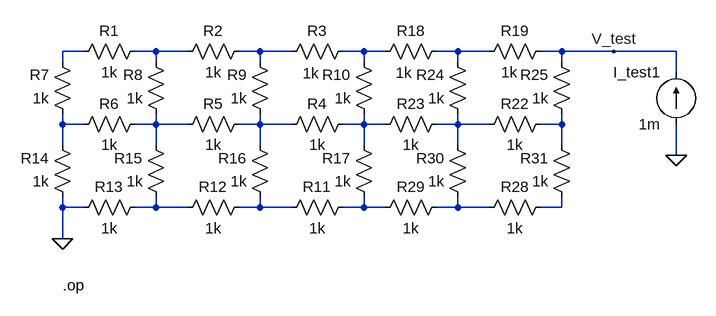
[diagram p0: schematic q2a_mesh_3.asc]
q2a_mesh_3.asc, the LTspice schematic file:
Version 4
SHEET 1 964 680
WIRE -128 48 -160 48
WIRE -16 48 -48 48
WIRE 32 48 -16 48
WIRE 144 48 112 48
WIRE 192 48 144 48
WIRE 304 48 272 48
WIRE 336 48 304 48
WIRE 448 48 416 48
WIRE 496 48 448 48
WIRE 608 48 576 48
WIRE 688 48 608 48
WIRE 784 48 688 48
WIRE -160 64 -160 48
WIRE -16 64 -16 48
WIRE 144 64 144 48
WIRE 304 64 304 48
WIRE 448 64 448 48
WIRE 608 64 608 48
WIRE 784 80 784 48
WIRE -160 160 -160 144
WIRE -128 160 -160 160
WIRE -16 160 -16 144
WIRE -16 160 -48 160
WIRE 32 160 -16 160
WIRE 144 160 144 144
WIRE 144 160 112 160
WIRE 192 160 144 160
WIRE 304 160 304 144
WIRE 304 160 272 160
WIRE 336 160 304 160
WIRE 448 160 448 144
WIRE 448 160 416 160
WIRE 496 160 448 160
WIRE 608 160 608 144
WIRE 608 160 576 160
WIRE -160 192 -160 160
WIRE -16 192 -16 160
WIRE 144 192 144 160
WIRE 304 192 304 160
WIRE 448 192 448 160
WIRE 608 192 608 160
WIRE 784 208 784 160
WIRE -160 288 -160 272
WIRE -128 288 -160 288
WIRE -16 288 -16 272
WIRE -16 288 -48 288
WIRE 32 288 -16 288
WIRE 144 288 144 272
WIRE 144 288 112 288
WIRE 192 288 144 288
WIRE 304 288 304 272
WIRE 304 288 272 288
WIRE 336 288 304 288
WIRE 448 288 448 272
WIRE 448 288 416 288
WIRE 496 288 448 288
WIRE 608 288 608 272
WIRE 608 288 576 288
WIRE -160 336 -160 288
FLAG -160 336 0
FLAG 784 208 0
FLAG 688 48 V_test
SYMBOL res -32 32 R90
WINDOW 0 0 56 VBottom 2
WINDOW 3 32 56 VTop 2
SYMATTR InstName R1
SYMATTR Value 1k
SYMBOL current 784 160 R180
WINDOW 0 24 80 Left 2
WINDOW 3 24 0 Left 2
SYMATTR InstName I_test1
SYMATTR Value 1m
SYMBOL res 128 32 R90
WINDOW 0 0 56 VBottom 2
WINDOW 3 32 56 VTop 2
SYMATTR InstName R2
SYMATTR Value 1k
SYMBOL res 288 32 R90
WINDOW 0 0 56 VBottom 2
WINDOW 3 34 66 VTop 2
SYMATTR InstName R3
SYMATTR Value 1k
SYMBOL res 288 144 R90
WINDOW 0 0 56 VBottom 2
WINDOW 3 32 56 VTop 2
SYMATTR InstName R4
SYMATTR Value 1k
SYMBOL res 128 144 R90
WINDOW 0 0 56 VBottom 2
WINDOW 3 32 56 VTop 2
SYMATTR InstName R5
SYMATTR Value 1k
SYMBOL res -32 144 R90
WINDOW 0 0 56 VBottom 2
WINDOW 3 32 56 VTop 2
SYMATTR InstName R6
SYMATTR Value 1k
SYMBOL res -144 160 R180
WINDOW 0 36 76 Left 2
WINDOW 3 36 40 Left 2
SYMATTR InstName R7
SYMATTR Value 1k
SYMBOL res 0 160 R180
WINDOW 0 36 76 Left 2
WINDOW 3 36 40 Left 2
SYMATTR InstName R8
SYMATTR Value 1k
SYMBOL res 160 160 R180
WINDOW 0 36 76 Left 2
WINDOW 3 36 40 Left 2
SYMATTR InstName R9
SYMATTR Value 1k
SYMBOL res 320 160 R180
WINDOW 0 36 76 Left 2
WINDOW 3 36 40 Left 2
SYMATTR InstName R10
SYMATTR Value 1k
SYMBOL res 288 272 R90
WINDOW 0 0 56 VBottom 2
WINDOW 3 32 56 VTop 2
SYMATTR InstName R11
SYMATTR Value 1k
SYMBOL res 128 272 R90
WINDOW 0 0 56 VBottom 2
WINDOW 3 32 56 VTop 2
SYMATTR InstName R12
SYMATTR Value 1k
SYMBOL res -32 272 R90
WINDOW 0 0 56 VBottom 2
WINDOW 3 32 56 VTop 2
SYMATTR InstName R13
SYMATTR Value 1k
SYMBOL res -144 288 R180
WINDOW 0 36 76 Left 2
WINDOW 3 36 40 Left 2
SYMATTR InstName R14
SYMATTR Value 1k
SYMBOL res 0 288 R180
WINDOW 0 36 76 Left 2
WINDOW 3 36 40 Left 2
SYMATTR InstName R15
SYMATTR Value 1k
SYMBOL res 160 288 R180
WINDOW 0 36 76 Left 2
WINDOW 3 36 40 Left 2
SYMATTR InstName R16
SYMATTR Value 1k
SYMBOL res 320 288 R180
WINDOW 0 36 76 Left 2
WINDOW 3 36 40 Left 2
SYMATTR InstName R17
SYMATTR Value 1k
SYMBOL res 432 32 R90
WINDOW 0 0 56 VBottom 2
WINDOW 3 33 67 VTop 2
SYMATTR InstName R18
SYMATTR Value 1k
SYMBOL res 592 32 R90
WINDOW 0 0 56 VBottom 2
WINDOW 3 32 64 VTop 2
SYMATTR InstName R19
SYMATTR Value 1k
SYMBOL res 592 144 R90
WINDOW 0 0 56 VBottom 2
WINDOW 3 32 56 VTop 2
SYMATTR InstName R22
SYMATTR Value 1k
SYMBOL res 432 144 R90
WINDOW 0 0 56 VBottom 2
WINDOW 3 32 56 VTop 2
SYMATTR InstName R23
SYMATTR Value 1k
SYMBOL res 464 160 R180
WINDOW 0 36 76 Left 2
WINDOW 3 36 40 Left 2
SYMATTR InstName R24
SYMATTR Value 1k
SYMBOL res 624 160 R180
WINDOW 0 36 76 Left 2
WINDOW 3 36 40 Left 2
SYMATTR InstName R25
SYMATTR Value 1k
SYMBOL res 592 272 R90
WINDOW 0 0 56 VBottom 2
WINDOW 3 32 56 VTop 2
SYMATTR InstName R28
SYMATTR Value 1k
SYMBOL res 432 272 R90
WINDOW 0 0 56 VBottom 2
WINDOW 3 32 56 VTop 2
SYMATTR InstName R29
SYMATTR Value 1k
SYMBOL res 464 288 R180
WINDOW 0 36 76 Left 2
WINDOW 3 36 40 Left 2
SYMATTR InstName R30
SYMATTR Value 1k
SYMBOL res 624 288 R180
WINDOW 0 36 76 Left 2
WINDOW 3 36 40 Left 2
SYMATTR InstName R31
SYMATTR Value 1k
TEXT -160 408 Left 2 !.op

The netlist it stands for:
* q2a_mesh_3.asc
R1 N002 N001 1k
I_test1 0 V_test 1m
R2 N003 N002 1k
R3 N004 N003 1k
R4 N009 N008 1k
R5 N008 N007 1k
R6 N007 N006 1k
R7 N006 N001 1k
R8 N007 N002 1k
R9 N008 N003 1k
R10 N009 N004 1k
R11 N014 N013 1k
R12 N013 N012 1k
R13 N012 0 1k
R14 0 N006 1k
R15 N012 N007 1k
R16 N013 N008 1k
R17 N014 N009 1k
R18 N005 N004 1k
R19 V_test N005 1k
R22 N011 N010 1k
R23 N010 N009 1k
R24 N010 N005 1k
R25 N011 V_test 1k
R28 N016 N015 1k
R29 N015 N014 1k
R30 N015 N010 1k
R31 N016 N011 1k
.op
.backanno
.end